# EAGLE design Makesafe_OptocoupledZCD (EAGLE 9.6.2)
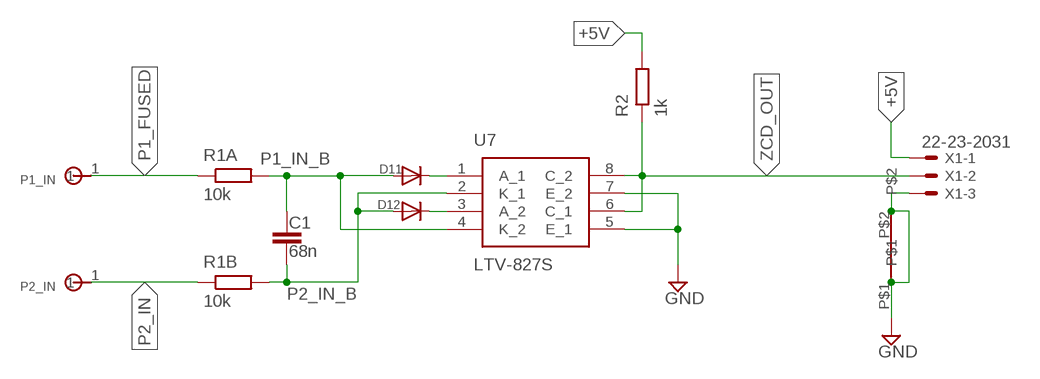
[diagram p0: schematic, sheet 1]

## Parts
C1  68n  TH_CAPACITOR  [0204/7_TH]
D11  DIODE  [0204/7_TH]
D12  DIODE  [0204/7_TH]
P1_IN  90MIL_TERMINAL  [90MIL_TERMINAL]
P2_IN  90MIL_TERMINAL  [90MIL_TERMINAL]
R1A  10k  TH_RESISTOR  [0204/7_TH]
R1B  10k  TH_RESISTOR  [0204/7_TH]
R2  1k  TH_RESISTOR  [0204/7_TH]
U7  LTV-827S  [SOP254P1016X460-8N]
U$1  JUMPER  [0204/7_TH]
X1  22-23-2031  [22-23-2031]

## Nets
+5V: R2.P$2 X1.1
GND: U7.5(E_1) U7.7(E_2) U$1.P$1 U$1.P$2 X1.3
N$3: D12.P$2(C) U7.3(A_2)
N$4: D11.P$2(C) U7.1(A_1)
P1_FUSED: P1_IN.1 R1A.P$1
P1_IN_B: C1.P$1 D11.P$1(A) R1A.P$2 U7.4(K_2)
P2_IN: P2_IN.1 R1B.P$1
P2_IN_B: C1.P$2 D12.P$1(A) R1B.P$2 U7.2(K_1)
ZCD_OUT: R2.P$1 U7.6(C_1) U7.8(C_2) X1.2

## Library data of the parts
C1 = ZCD_Parts:TH_CAPACITOR
D11 D12 = ZCD_Parts:DIODE
P1_IN P2_IN = ZCD_Parts:90MIL_TERMINAL
R1A R1B R2 = ZCD_Parts:TH_RESISTOR
U7 = ZCD_Parts:LTV-827S: Transistor Output Optocouplers Optocplr Phototrans 2-CHNL Source: Datasheet <https://www.mouser.mx/datasheet/2/239/LTV-8X7_series_201610_-1544776.pdf>; DESCRIPTION: Transistor Output Optocouplers Optocplr Phototrans 2-CHNL; HEIGHT: 4.6mm; MANUFACTURER_NAME: Lite-On; MANUFACTURER_PART_NUMBER: LTV-827S; MOUSER_PART_NUMBER: 859-LTV-827S; MOUSER_PRICE-STOCK: https://www.mouser.co.uk/ProductDetail/Lite-On/LTV-827S?qs=5m%252ByTwlvhMUJgq90MY9meQ%3D%3D
U$1 = ZCD_Parts:JUMPER
X1 = con-molex:22-23-2031: .100" (2.54mm) Center Header - 3 Pin; MF: MOLEX; MPN: 22-23-2031; OC_FARNELL: 1462950; OC_NEWARK: 30C0862

## Board
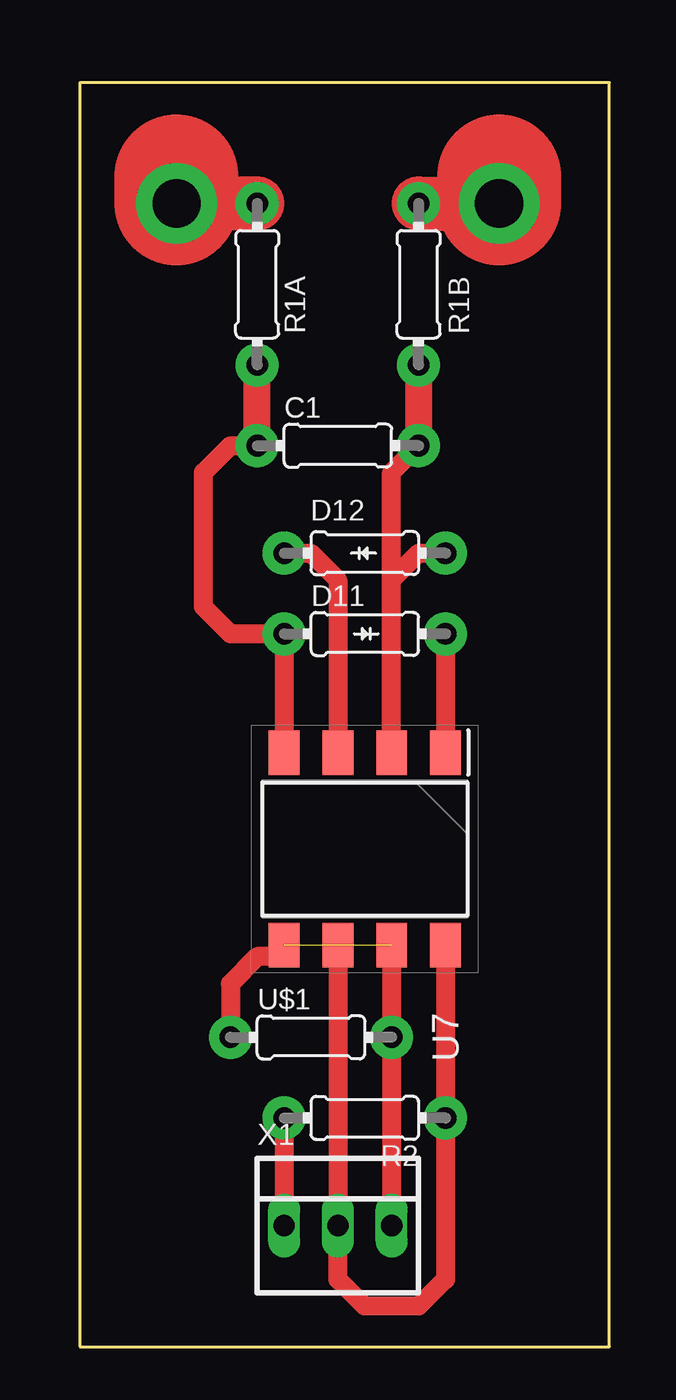
[diagram p1: board, top side]

Size 25.07 x 59.68 mm. Coordinates in mm from the lower left corner, seen from the top.
Outline: 0,0 25.07,0 25.07,59.68 0,59.68 0,0
Copper layers (1*16): Top 0.035mm / dielectric 1.5mm / Bottom 0.035mm
Design rules "default": minimum track width 6mil, minimum drill 0.35mm, track to track 6mil, track to pad 6mil, pad to pad 6mil, via to via 6mil, smd to smd 6mil, copper to edge 40mil, drill to drill 6mil, minimum pad ring 10mil, minimum via ring 8mil, stop-mask expansion 4mil, vias tented up to drill 0mil, thermal gap 10mil
Milling: area 0,0 to 25,59.7

### Footprints (pad centres in the part's own frame; a part is rotated, then mirrored left to right if it is on the bottom)
0204/7_TH = drill 1.016 pad 2.032: P$1 -3.81,0; P$2 3.81,0
90MIL_TERMINAL = drill 2.286 pad 3.81: 1 0,0
SOP254P1016X460-8N = smd 2.1 x 1.45: 1 -4.55,3.81; 2 -4.55,1.27; 3 -4.55,-1.27; 4 -4.55,-3.81; 5 4.55,-3.81; 6 4.55,-1.27; 7 4.55,1.27; 8 4.55,3.81
22-23-2031 = drill 1 long: 1 -2.54,0; 2 0,0; 3 2.54,0

### Placement (x,y rotation side)
C1  12.19,42.55 0 top
D11  13.46,33.66 0 top
D12  13.46,37.47 180 top
P1_IN  4.57,53.98 0 top
P2_IN  19.81,53.98 0 top
R1A  8.38,50.16 270 top
R1B  16,50.16 270 top
R2  13.46,10.79 180 top
U7  13.46,23.5 270 top
U$1  10.92,14.61 0 top
X1  12.19,5.71 0 top

### Tracks (layer width: path | path; a pad name or v marks a point on that pad's centre or on a via)
+5V
  Top 0.889: R2.P$2 X1.1
GND  (1 unrouted)
  Top 0.889: U7.5 9.12,18.41 8.38,18.41 7.11,17.14 U$1.P$1 | X1.3 U$1.P$2 U7.7
N$3
  Top 0.889: D12.P$2 10.92,37.47 12.19,36.2 U7.3
N$4
  Top 0.889: D11.P$2 U7.1
P1_FUSED
  Top 2.54: R1A.P$1 P1_IN.1
  Top 5.842: P1_IN.1 4.57,55.24
P1_IN_B
  Top 0.889: U7.4 D11.P$1 7.11,33.66 5.84,34.92 5.84,41.27 7.11,42.55 C1.P$1
  Top 1.27: C1.P$1 R1A.P$2
P2_IN
  Top 2.54: R1B.P$1 P2_IN.1
  Top 5.842: P2_IN.1 19.81,55.24
P2_IN_B
  Top 0.889: 14.73,36.2 16,37.47 D12.P$1 | U7.2 14.73,36.2 | 14.73,36.2 14.73,41.27 C1.P$2
  Top 1.27: R1B.P$2 C1.P$2
ZCD_OUT
  Top 0.889: U7.8 R2.P$1 17.27,3.17 16,1.91 13.46,1.91 12.19,3.17 X1.2 U7.6